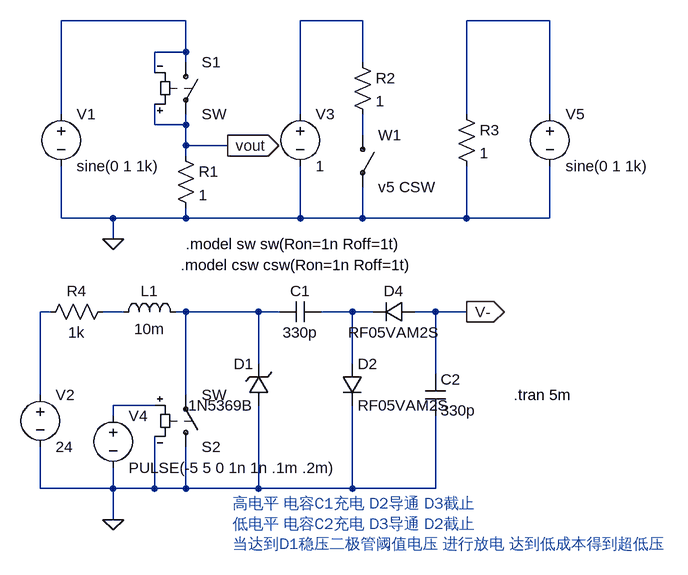
[diagram p0: schematic Draft1.asc]
Draft1.asc, the LTspice schematic file:
Version 4
SHEET 1 1088 916
WIRE 368 112 176 112
WIRE 640 112 544 112
WIRE 928 112 800 112
WIRE 368 160 368 112
WIRE 368 160 320 160
WIRE 368 176 368 160
WIRE 640 176 640 112
WIRE 320 192 320 160
WIRE 176 256 176 112
WIRE 544 256 544 112
WIRE 800 256 800 112
WIRE 928 256 928 112
WIRE 320 272 320 240
WIRE 368 272 368 256
WIRE 368 272 320 272
WIRE 640 288 640 256
WIRE 368 304 368 272
WIRE 432 304 368 304
WIRE 368 320 368 304
WIRE 176 416 176 336
WIRE 256 416 176 416
WIRE 368 416 368 400
WIRE 368 416 256 416
WIRE 544 416 544 336
WIRE 544 416 368 416
WIRE 640 416 640 368
WIRE 640 416 544 416
WIRE 800 416 800 336
WIRE 800 416 640 416
WIRE 928 416 928 336
WIRE 928 416 800 416
WIRE 256 448 256 416
WIRE 160 560 144 560
WIRE 272 560 240 560
WIRE 368 560 352 560
WIRE 480 560 368 560
WIRE 512 560 480 560
WIRE 624 560 576 560
WIRE 656 560 624 560
WIRE 752 560 720 560
WIRE 800 560 752 560
WIRE 480 640 480 560
WIRE 624 640 624 560
WIRE 752 656 752 560
WIRE 144 688 144 560
WIRE 368 688 368 560
WIRE 320 704 256 704
WIRE 256 720 256 704
WIRE 144 832 144 768
WIRE 256 832 256 800
WIRE 256 832 144 832
WIRE 320 832 320 752
WIRE 320 832 256 832
WIRE 368 832 368 768
WIRE 368 832 320 832
WIRE 480 832 480 704
WIRE 480 832 368 832
WIRE 624 832 624 704
WIRE 624 832 480 832
WIRE 752 832 752 720
WIRE 752 832 624 832
WIRE 256 880 256 832
FLAG 256 448 0
FLAG 432 304 vout
IOPIN 432 304 Out
FLAG 256 880 0
FLAG 800 560 V-
IOPIN 800 560 Out
SYMBOL Voltage 176 240 R0
SYMATTR InstName V1
SYMATTR Value sine(0 1 1k)
SYMBOL sw 368 160 R0
SYMATTR InstName S1
SYMBOL Res 352 304 R0
SYMATTR InstName R1
SYMATTR Value 1
SYMBOL Voltage 544 240 R0
SYMATTR InstName V3
SYMATTR Value 1
SYMBOL Res 624 160 R0
SYMATTR InstName R2
SYMATTR Value 1
SYMBOL csw 640 288 R0
SYMATTR InstName W1
SYMATTR Value v5 CSW
SYMBOL Voltage 928 240 R0
SYMATTR InstName V5
SYMATTR Value sine(0 1 1k)
SYMBOL Res 784 240 R0
SYMATTR InstName R3
SYMATTR Value 1
SYMBOL Voltage 144 672 R0
SYMATTR InstName V2
SYMATTR Value 24
SYMBOL Res 144 576 R270
WINDOW 0 32 56 VTop 2
WINDOW 3 0 56 VBottom 2
SYMATTR InstName R4
SYMATTR Value 1k
SYMBOL Ind 256 576 R270
WINDOW 0 32 56 VTop 2
WINDOW 3 5 56 VBottom 2
SYMATTR InstName L1
SYMATTR Value 10m
SYMBOL sw 368 784 M180
SYMATTR InstName S2
SYMBOL Voltage 256 704 R0
SYMATTR InstName V4
SYMATTR Value PULSE(-5 5 0 1n 1n .1m .2m)
SYMBOL zener 496 704 R180
WINDOW 0 24 64 Left 2
WINDOW 3 24 0 Left 2
SYMATTR InstName D1
SYMATTR Value 1N5369B
SYMATTR Description Diode
SYMATTR Type diode
SYMBOL diode 608 640 R0
SYMATTR InstName D2
SYMATTR Value RF05VAM2S
SYMBOL diode 720 544 R90
WINDOW 0 0 32 VBottom 2
WINDOW 3 32 32 VTop 2
SYMATTR InstName D4
SYMATTR Value RF05VAM2S
SYMBOL Cap 576 544 R90
WINDOW 0 0 32 VBottom 2
WINDOW 3 32 32 VTop 2
SYMATTR InstName C1
SYMATTR Value 330p
SYMBOL Cap 736 656 R0
SYMATTR InstName C2
SYMATTR Value 330p
TEXT 368 456 Left 2 !.model sw sw(Ron=1n Roff=1t)
TEXT 360 488 Left 2 !.model csw csw(Ron=1n Roff=1t)
TEXT 872 688 Left 2 !.tran 5m
TEXT 440 856 Left 2 ;高电平 电容C1充电 D2导通 D3截止\n低电平 电容C2充电 D3导通 D2截止\n当达到D1稳压二极管阈值电压 进行放电 达到低成本得到超低压

The netlist it stands for:
* Draft1.asc
V1 N001 0 sine(0 1 1k)
S1 N001 vout vout N001 SW
R1 vout 0 1
V3 N002 0 1
R2 N002 N004 1
W1 N004 0 v5 CSW
V5 N003 0 sine(0 1 1k)
R3 N003 0 1
V2 N005 0 24
R4 N005 N006 1k
L1 N006 N007 10m
S2 0 N007 N009 0 SW
V4 N009 0 PULSE(-5 5 0 1n 1n .1m .2m)
D1 0 N007 1N5369B
D2 N008 0 RF05VAM2S
D4 V- N008 RF05VAM2S
C1 N008 N007 330p
C2 V- 0 330p
.model D D
.lib standard.dio
.model sw sw(Ron=1n Roff=1t)
.model csw csw(Ron=1n Roff=1t)
.tran 5m
* 高电平 电容C1充电 D2导通 D3截止
* 低电平 电容C2充电 D3导通 D2截止
* 当达到D1稳压二极管阈值电压 进行放电 达到低成本得到超低压
.backanno
.end